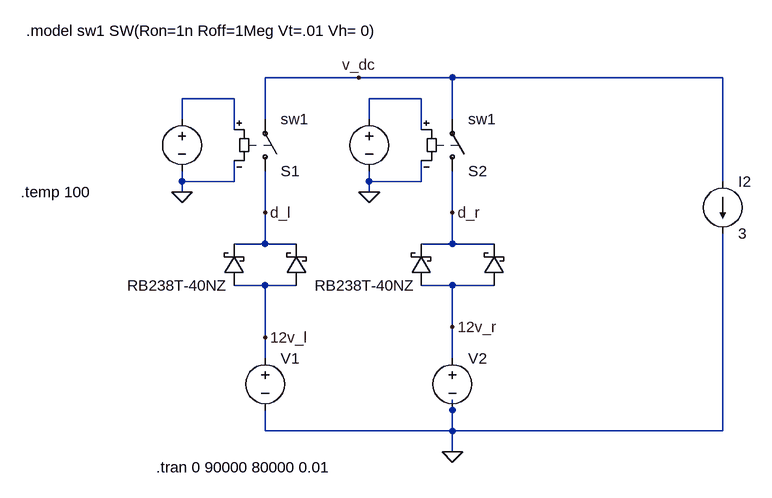
[diagram p0: schematic rct_battery.asc]
rct_battery.asc, the LTspice schematic file:
Version 4
SHEET 1 2228 680
WIRE 544 -608 400 -608
WIRE 688 -608 544 -608
WIRE 1104 -608 688 -608
WIRE 352 -576 272 -576
WIRE 640 -576 560 -576
WIRE 272 -544 272 -576
WIRE 400 -544 400 -608
WIRE 560 -544 560 -576
WIRE 688 -544 688 -608
WIRE 352 -528 352 -576
WIRE 640 -528 640 -576
WIRE 272 -448 272 -464
WIRE 352 -448 352 -480
WIRE 352 -448 272 -448
WIRE 560 -448 560 -464
WIRE 640 -448 640 -480
WIRE 640 -448 560 -448
WIRE 1104 -448 1104 -608
WIRE 272 -432 272 -448
WIRE 560 -432 560 -448
WIRE 400 -400 400 -464
WIRE 688 -400 688 -464
WIRE 400 -352 400 -400
WIRE 400 -352 352 -352
WIRE 448 -352 400 -352
WIRE 688 -352 688 -400
WIRE 688 -352 640 -352
WIRE 752 -352 688 -352
WIRE 400 -288 352 -288
WIRE 448 -288 400 -288
WIRE 688 -288 640 -288
WIRE 752 -288 688 -288
WIRE 688 -224 688 -288
WIRE 400 -208 400 -288
WIRE 400 -176 400 -208
WIRE 688 -176 688 -224
WIRE 688 -96 688 -112
WIRE 400 -64 400 -96
WIRE 688 -64 688 -96
WIRE 688 -64 400 -64
WIRE 1104 -64 1104 -368
WIRE 1104 -64 688 -64
WIRE 688 -32 688 -64
FLAG 688 -32 0
FLAG 272 -432 0
FLAG 560 -432 0
FLAG 400 -208 12v_l
FLAG 688 -224 12v_r
FLAG 400 -400 d_l
FLAG 688 -400 d_r
FLAG 544 -608 v_dc
SYMBOL voltage 400 -192 R0
WINDOW 3 24 96 Invisible 2
WINDOW 123 0 0 Left 0
WINDOW 39 0 0 Left 0
SYMATTR Value PWL(0 12.6 86400 12.05 87200 12.05 87200.00001 0)
SYMATTR InstName V1
SYMBOL voltage 688 -192 R0
WINDOW 3 24 96 Invisible 2
WINDOW 123 0 0 Left 0
WINDOW 39 0 0 Left 0
SYMATTR Value PWL(86400 0 86400.00001 12.6)
SYMATTR InstName V2
SYMBOL schottky 368 -288 R180
WINDOW 0 24 64 Invisible 2
WINDOW 3 24 0 Left 2
SYMATTR InstName D1
SYMATTR Value RB238T-40NZ
SYMBOL schottky 656 -288 R180
WINDOW 0 24 64 Invisible 2
WINDOW 3 24 0 Left 2
SYMATTR InstName D2
SYMATTR Value RB238T-40NZ
SYMBOL sw 400 -448 M180
SYMATTR InstName S1
SYMATTR Value sw1
SYMBOL sw 688 -448 M180
SYMATTR InstName S2
SYMATTR Value sw1
SYMBOL current 1104 -448 R0
WINDOW 123 0 0 Left 0
WINDOW 39 0 0 Left 0
SYMATTR InstName I2
SYMATTR Value 3
SYMBOL voltage 272 -560 R0
WINDOW 0 24 16 Invisible 2
WINDOW 3 24 44 Invisible 2
WINDOW 123 0 0 Left 0
WINDOW 39 0 0 Left 0
SYMATTR InstName V3
SYMATTR Value PWL(86440 1 86700 0)
SYMBOL voltage 560 -560 R0
WINDOW 0 24 16 Invisible 2
WINDOW 3 24 96 Invisible 2
WINDOW 123 0 0 Left 0
WINDOW 39 0 0 Left 0
SYMATTR InstName V4
SYMATTR Value PWL(86400 0 86420 1)
SYMBOL schottky 464 -288 R180
WINDOW 0 24 64 Invisible 2
WINDOW 3 24 0 Invisible 2
SYMATTR InstName D3
SYMATTR Value RB238T-40NZ
SYMBOL schottky 768 -288 R180
WINDOW 0 24 64 Invisible 2
WINDOW 3 24 0 Invisible 0
SYMATTR InstName D4
SYMATTR Value RB238T-40NZ
TEXT 232 -8 Left 2 !.tran 0 90000 80000 0.01
TEXT 32 -680 Left 2 !.model sw1 SW(Ron=1n Roff=1Meg Vt=.01 Vh= 0)
TEXT 24 -432 Left 2 !.temp 100

The netlist it stands for:
* rct_battery.asc
V1 12v_l 0 PWL(0 12.6 86400 12.05 87200 12.05 87200.00001 0)
V2 12v_r 0 PWL(86400 0 86400.00001 12.6)
D1 12v_l d_l RB238T-40NZ
D2 12v_r d_r RB238T-40NZ
S1 d_l v_dc N001 0 sw1
S2 d_r v_dc N002 0 sw1
I2 v_dc 0 3
V3 N001 0 PWL(86440 1 86700 0)
V4 N002 0 PWL(86400 0 86420 1)
D3 12v_l d_l RB238T-40NZ
D4 12v_r d_r RB238T-40NZ
.model D D
.lib standard.dio
.tran 0 90000 80000 0.01
.model sw1 SW(Ron=1n Roff=1Meg Vt=.01 Vh= 0)
.temp 100
.backanno
.end